# Altium schematic sheet CH32V003F4P6-R0-1v1.SchDoc
size 304 x 203 mm; SheetNumber: 0; SheetTotal: 0
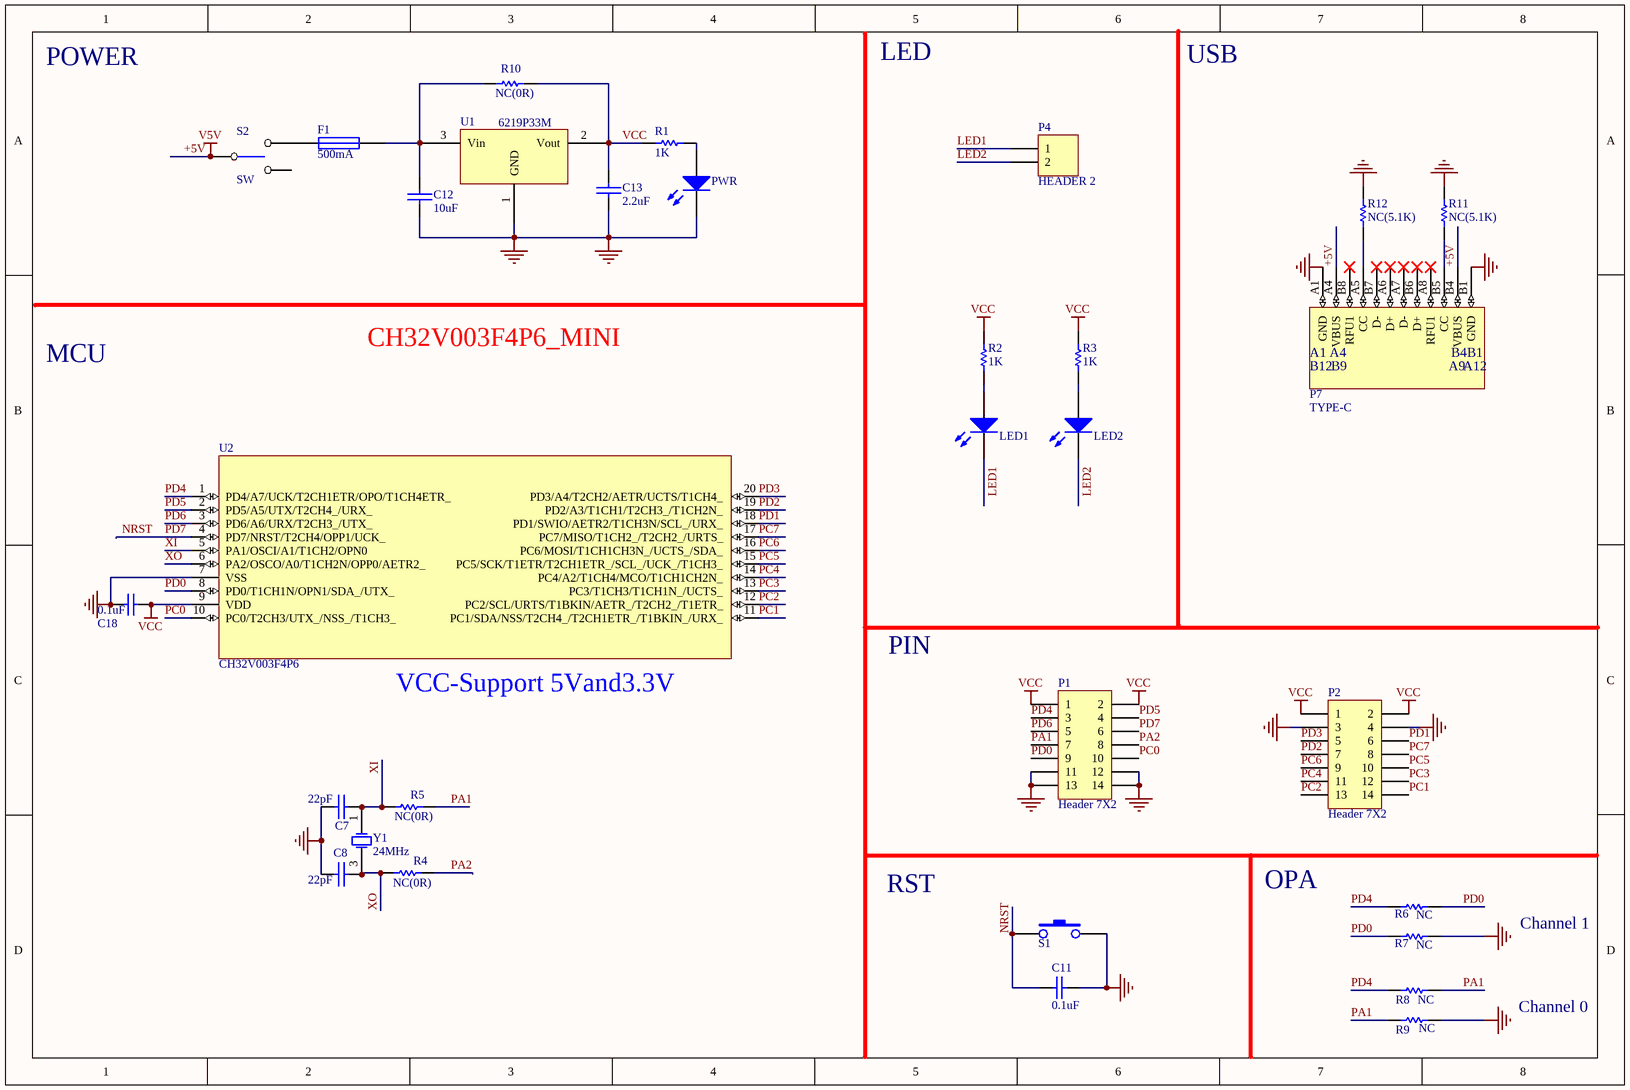
[diagram p0: CH32V003F4P6-R0-1v1.SchDoc]

## Parts
C7  22pF  [0603_C]
C8  22pF  [0603_C]
C11  0.1uF  [0603_C]
C12  10uF  [3216_C]
C13  2.2uF  [0603_C]
C18  0.1uF  [0603_C]
F1  500mA  [0603]
LED1  LED1   blue  [0603+]  (value not drawn)
LED2  LED2  blue  [0603+]  (value not drawn)
P1  Header 7X2  [IDC14-2.54mm]
P2  Header 7X2  [IDC14-2.54mm]
P4  HEADER 2  [SIP2-2.54mm]
P7  TYPE-C  [TYPE-C-Receptacle-2.0]
PWR  POWER  red  [0603+]  (value not drawn)
R1  1K  [0603]
R2  1K  [0603]
R3  1K  [0603]
R4  value NC(0R)  [0603]  (hidden comment: 0R)
R5  value NC(0R)  [0603]  (hidden comment: 0R)
R6  value NC  [0603]  (hidden comment: 0R)
R7  value NC  [0603]  (hidden comment: 0R)
R8  value NC  [0603]  (hidden comment: 0R)
R9  value NC  [0603]  (hidden comment: 0R)
R10  value NC(0R)  [0603]  (hidden comment: 0R)
R11  value NC(5.1K)  [0603]  (hidden comment: 0R)
R12  value NC(5.1K)  [0603]  (hidden comment: 0R)
S1  NRST  [SMD_6.1x3.65x2.5mm-KEY]  (value not drawn)
S2  SW  [SW1]
U1  6219P33M  [SOT-23]
U2  CH32V003F4P6
Y1  24MHz  [XT3225]

## Nets
+5V: P7.A4(VBUS) P7.B4(VBUS) S2.1  [also labelled V5V]
GND: C7.1 C8.1 C11.1 C12.2 C13.1 C18.1 P1.11 P1.12 P1.13 P1.14 P2.3 P2.4 P7.A1(GND) P7.B1(GND) PWR.2(K) R7.2 R9.2 R11.2 R12.2 S1.2 U1.1(GND) U2.7(VSS)
VCC: C13.2 C18.2 P1.1 P1.2 P2.1 P2.2 R1.2 R2.1 R3.1 R10.2 U1.2(Vout) U2.9(VDD)
LED1: LED1.2(K) P4.1
LED2: LED2.2(K) P4.2
NRST: C11.2 P1.6 S1.1 U2.4(PD7/NRST/T2CH4/OPP1/UCK_)  [also labelled PD7]
PA1: P1.7 R5.2 R8.2 R9.1
PA2: P1.8 R4.2
PC0: P1.10 U2.10(PC0/T2CH3/UTX_/NSS_/T1CH3_)
PC1: P2.14 U2.11(PC1/SDA/NSS/T2CH4_/T2CH1ETR_/T1BKIN_/URX_)
PC2: P2.13 U2.12(PC2/SCL/URTS/T1BKIN/AETR_/T2CH2_/T1ETR_)
PC3: P2.12 U2.13(PC3/T1CH3/T1CH1N_/UCTS_)
PC4: P2.11 U2.14(PC4/A2/T1CH4/MCO/T1CH1CH2N_)
PC5: P2.10 U2.15(PC5/SCK/T1ETR/T2CH1ETR_/SCL_/UCK_/T1CH3_)
PC6: P2.9 U2.16(PC6/MOSI/T1CH1CH3N_/UCTS_/SDA_)
PC7: P2.8 U2.17(PC7/MISO/T1CH2_/T2CH2_/URTS_)
PD0: P1.9 R6.2 R7.1 U2.8(PD0/T1CH1N/OPN1/SDA_/UTX_)
PD1: P2.6 U2.18(PD1/SWIO/AETR2/T1CH3N/SCL_/URX_)
PD2: P2.7 U2.19(PD2/A3/T1CH1/T2CH3_/T1CH2N_)
PD3: P2.5 U2.20(PD3/A4/T2CH2/AETR/UCTS/T1CH4_)
PD4: P1.3 R6.1 R8.1 U2.1(PD4/A7/UCK/T2CH1ETR/OPO/T1CH4ETR_)
PD5: P1.4 U2.2(PD5/A5/UTX/T2CH4_/URX_)
PD6: P1.5 U2.3(PD6/A6/URX/T2CH3_/UTX_)
XI: C7.2 R5.1 U2.5(PA1/OSCI/A1/T1CH2/OPN0) Y1.1(OSC1)
XO: C8.2 R4.1 U2.6(PA2/OSCO/A0/T1CH2N/OPP0/AETR2_) Y1.3(OSC2)
NetC12_1: C12.1 F1.2 R10.1 U1.3(Vin)
NetF1_1: F1.1 S2.3
NetLED1_1: LED1.1(A) R2.2
NetLED2_1: LED2.1(A) R3.2
NetP7_A5: P7.A5(CC) R12.1
NetP7_B5: P7.B5(CC) R11.1
NetPWR_1: PWR.1(A) R1.1

Not connected (* = marked no-connect by the designer): P7 A6(D+)* A7(D-)* A8(RFU1)* B6(D+)* B7(D-)* B8(RFU1)*; S2 2

## Notes on the sheet
- POWER
- LED
- USB
- MCU
- CH32V003F4P6_MINI
- (near U2) VCC-Support 5Vand3.3V
- PIN
- RST
- OPA
- Channel 1
- Channel 0
- Title
- Size:
- Date:
- A3
- Number:
- Time:
- Revision:
- Sheet
- of
- File:
- (in symbol TYPE-C1) B12; B9; A9; A12

## Library data of the parts
C7 C8 C12 C13 = CAP: Capacitor
C11 = Cap: Capacitor; Published: 8-Jun-2000; LatestRevisionDate: 17-Jul-2002; LatestRevisionNote: Re-released for DXP Platform.; PackageReference: RAD-0.3; Publisher: Altium Limited; Value: 0.1uF
C18 = Cap: Capacitor; Value: 15pF; Published: 8-Jun-2000; LatestRevisionDate: 17-Jul-2002; LatestRevisionNote: Re-released for DXP Platform.; PackageReference: RAD-0.3; Publisher: Altium Limited
F1 = FUSE1: Fuse
LED1 LED2 PWR = LED0: Typical INFRARED GaAs LED; Published: 8-Jun-2000; LatestRevisionDate: 08-Jul-2005; LatestRevisionNote: Mech Layer 1 removed.; PackageReference: LED-0; Publisher: Altium Limited
P1 P2 = Header 7X2: Header, 7-Pin, Dual row; LatestRevisionDate: 17-Jul-2002; LatestRevisionNote: Re-released for DXP Platform.; Publisher: Altium Limited
P4 = HEADER 2: Header, 2-Pin
P7 = TYPE-C1
R1-R12 = Res Semi: Semiconductor Resistor; Published: 8-Jun-2000; LatestRevisionDate: 17-Jul-2002; LatestRevisionNote: Re-released for DXP Platform.; PackageReference: AXIAL-0.5; Publisher: Altium Limited
  R1-R3: Value: 1K
S1 = KEY
U2 = CH32V003F4P6: RISC-V MCU, 48MHz
Y1 = XTAL: Crystal Oscillator; Published: 8-Jun-2000; LatestRevisionDate: 17-Jul-2002; LatestRevisionNote: Re-released for DXP Platform.; PackageReference: R38; Publisher: Altium Limited; PackageDescription: Crystal, Thru-Hole; 2 Leads; Body 3.1 x 8.2 mm (Dia.xH)